# EAGLE design 副机 插座 v0.4 (EAGLE 6.3)
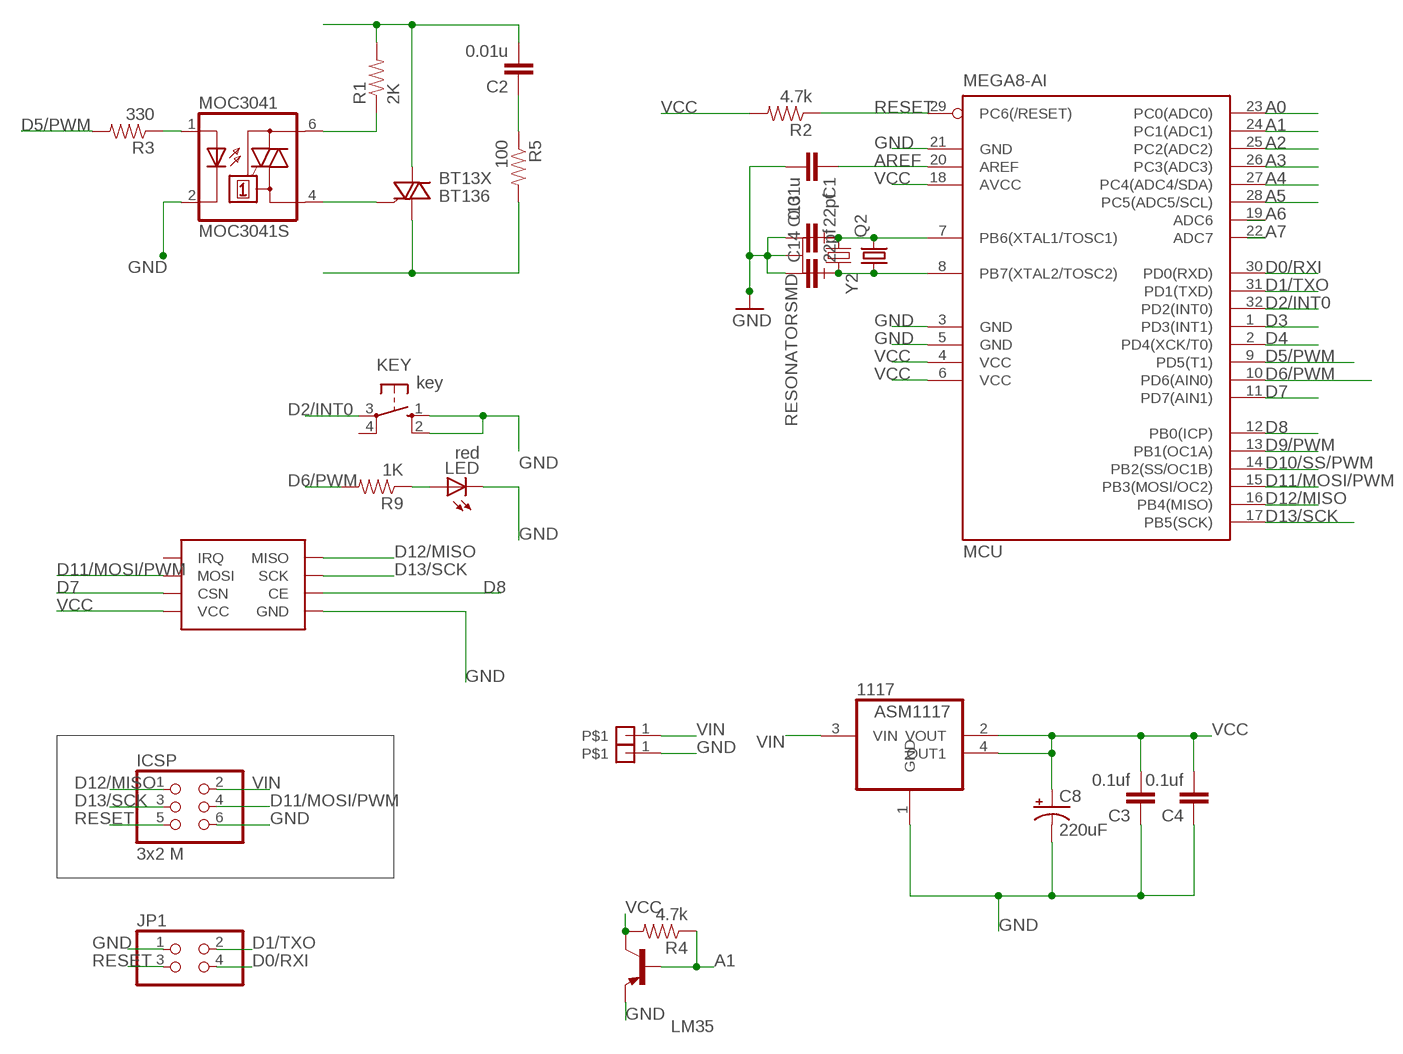
[diagram p0: schematic, sheet 1]

## Parts
1117  ASM1117  [SOT223]
BT13X  BT136  [TO252]
C1  0.01u  CAP0603-CAP  [0603-CAP]
C2  0.01u  C-EU050-024X044  [C050-024X044]
C3  0.1uf  CAP0603-CAP  [0603-CAP]
C4  0.1uf  CAP0603-CAP  [0603-CAP]
C8  220uF  CAP_POL3528  [EIA3528]
C13  22pf  CAP0603-CAP  [0603-CAP]
C14  22pf  CAP0603-CAP  [0603-CAP]
ICSP  3x2 M  PINHD-2X3  [2X03]
JP1  PINHD-2X2  [2X02]
KEY  key  10-XX  [B3F-10XX]
LED  red  LED3MM  [LED3MM]
LM35  -PNP-TO92-E1  [TO92-E1]
MCU  MEGA8-AI  [TQFP32-08]
MOC3041  MOC3041S  [DIL6-SMD]
Q2  CRYSTALHC49S  [HC49/S]
R1  2K  RESISTORPTH1  [AXIAL-0.3]
R2  4.7k  RESISTOR0603-RES  [0603-RES]
R3  330  RESISTOR0603-RES  [0603-RES]
R4  4.7k  RESISTOR0603-RES  [0603-RES]
R5  100  RESISTORPTH1  [AXIAL-0.3]
R9  1K  RESISTOR0603-RES  [0603-RES]
U$3  PIN1  [PIN1]
U$4  PIN1  [PIN1]
U$6  NRF  [NRF]
Y2  RESONATORSMD  [RESONATOR-SMD]

## Nets
A0: MCU.23(PC0(ADC0))
A1: LM35.2(B) MCU.24(PC1(ADC1)) R4.1
A2: MCU.25(PC2(ADC2))
A3: MCU.26(PC3(ADC3))
A4: MCU.27(PC4(ADC4/SDA))
A5: MCU.28(PC5(ADC5/SCL))
A6: MCU.19(ADC6)
A7: MCU.22(ADC7)
AREF: C1.1 MCU.20(AREF)
D0/RXI: JP1.4 MCU.30(PD0(RXD))
D1/TXO: JP1.2 MCU.31(PD1(TXD))
D2/INT0: KEY.3(P) MCU.32(PD2(INT0))
D3: MCU.1(PD3(INT1))
D4: MCU.2(PD4(XCK/T0))
D5/PWM: MCU.9(PD5(T1)) R3.2
D6/PWM: MCU.10(PD6(AIN0)) R9.2
D7: MCU.11(PD7(AIN1)) U$6.P$4(CSN)
D8: MCU.12(PB0(ICP)) U$6.P$3(CE)
D9/PWM: MCU.13(PB1(OC1A))
D10/SS/PWM: MCU.14(PB2(SS/OC1B))
D11/MOSI/PWM: ICSP.4 MCU.15(PB3(MOSI/OC2)) U$6.P$6(MOSI)
D12/MISO: ICSP.1 MCU.16(PB4(MISO)) U$6.P$7(MISO)
D13/SCK: ICSP.3 MCU.17(PB5(SCK)) U$6.P$5(SCK)
GND: 1117.1(GND) C1.2 C3.1 C4.1 C8.C(-) C13.1 C14.1 ICSP.6 JP1.1 KEY.1(S) KEY.2(S1) LED.K(C) LM35.3(E) MCU.3(GND) MCU.5(GND) MCU.21(GND) MOC3041.2(C) U$4.1 U$6.P$1(GND) Y2.2
IN: BT13X.3(A2) C2.2 R1.P$2
N$1: MOC3041.6(A2) R1.P$1
N$2: BT13X.2(G) MOC3041.4(A1)
N$3: C2.1 R5.P$1
N$15: LED.A R9.1
N$34: C13.2 MCU.7(PB6(XTAL1/TOSC1)) Q2.2 Y2.1
N$35: C14.2 MCU.8(PB7(XTAL2/TOSC2)) Q2.1 Y2.3
OUT: BT13X.1(A1) R5.P$2
P1: MOC3041.1(A) R3.1
RESET: ICSP.5 JP1.3 MCU.29(PC6(/RESET)) R2.1
VCC: 1117.2(VOUT) 1117.4(OUT1) C3.2 C4.2 C8.A(+) LM35.1(C) MCU.4(VCC) MCU.6(VCC) MCU.18(AVCC) R2.2 R4.2 U$6.P$2(VCC)
VIN: 1117.3(VIN) ICSP.2 U$3.1
Unconnected: KEY.4(P1) U$6.P$8(IRQ)

## Library data of the parts
1117 = MY3:ASM1117: 800mA and 1A Low Dropout (LDO) Positive Regulator 1.8V, 2.5V, 2.85V, 3.3V, 5V, and Adj; MPN: REG1117; OC_FARNELL: 1097566; OC_NEWARK: 14P6981
BT13X = PKJ:BT136: Triac BT136 series E sensitive gate Source: http://www.nxp.com/acrobat_download/datasheets/BT136_SERIES_E_2.pdf
C1 = MY2:CAP: Capacitor Standard 0603 ceramic capacitor, and 0.1" leaded capacitor.
C2 = resistor:C-EU: CAPACITOR, European symbol
C3 C4 = MY:CAP: Capacitor Standard 0603 ceramic capacitor, and 0.1" leaded capacitor.
C8 = MY:CAP_POL: Capacitor Polarized These are standard SMD and PTH capacitors. Normally 10uF, 47uF, and 100uF in electrolytic and tantalum varieties. Always verify the external diameter of the through hole cap, it varies with capacity, voltage, and manufacturer. The EIA devices should be standard.
C13 C14 = 00my:CAP: Capacitor Standard 0603 ceramic capacitor, and 0.1" leaded capacitor.
ICSP = SmartPrj:PINHD-2X3: PIN HEADER
JP1 = pinhead:PINHD-2X2: PIN HEADER
KEY = switch-omron:10-XX: OMRON SWITCH; MPN: B3F-1000; OC_FARNELL: 176432; OC_NEWARK: 36M3542
LED = led:LED: LED OSRAM: - CHIPLED LG R971, LG N971, LY N971, LG Q971, LY Q971, LO R971, LY R971 LH N974, LH R974 LS Q976, LO Q976, LY Q976 LO Q996 - Hyper CHIPLED LW Q18S LB Q993, LB Q99A, LB R99A - SideLED LS A670, LO A670, LY A670, LG A670, LP A670 LB A673, LV A673, LT A673, LW A673 LH A674 LY A675 LS A676, LA A676, LO A676, LY A676, LW A676 LS A679, LY A679, LG A679 - Hyper Micro SIDELED® LS Y876, LA Y876, LO Y876, LY Y876 LT Y87S - SmartLED LW L88C, LW L88S LB L89C, LB L89S, LG L890 LS L89K, LO L89K, LY L89K LS L896, LA L896, LO L896, LY L896 - TOPLED LS T670, LO T670, LY T670, LG T670, LP T670 LSG T670, LSP T670, LSY T670, LOP T670, LYG T670 LG T671, LOG T671, LSG T671 LB T673, LV T673, LT T673, LW T673 LH T674 LS T676, LA T676, LO T676, LY T676, LB T676, LH T676, LSB T676, LW T676 LB T67C, LV T67C, LT T67C, LS T67K, LO T67K, LY T67K, LW E67C LS E67B, LA E67B, LO E67B, LY E67B, LB E67C, LV E67C, LT E67C LW T67C LS T679, LY T679, LG T679 LS T770, LO T770, LY T770, LG T770, LP T770 LB T773, LV T773, LT T773, LW T773 LH T774 LS E675, LA E675, LY E675, LS T675 LS T776, LA T776, LO T776, LY T776, LB T776 LHGB T686 LT T68C, LB T68C - Hyper Mini TOPLED® LB M676 - Mini TOPLED Santana® LG M470 LS M47K, LO M47K, LY M47K Source: http://www.osram.convergy.de LUXEON: - LUMILED® LXK2-PW12-R00, LXK2-PW12-S00, LXK2-PW14-U00, LXK2-PW14-V00 LXK2-PM12-R00, LXK2-PM12-S00, LXK2-PM14-U00 LXK2-PE12-Q00, LXK2-PE12-R00, LXK2-PE12-S00, LXK2-PE14-T00, LXK2-PE14-U00 LXK2-PB12-K00, LXK2-PB12-L00, LXK2-PB12-M00, LXK2-PB14-N00, LXK2-PB14-P00, LXK2-PB14-Q00 LXK2-PR12-L00, LXK2-PR12-M00, LXK2-PR14-Q00, LXK2-PR14-R00 LXK2-PD12-Q00, LXK2-PD12-R00, LXK2-PD12-S00 LXK2-PH12-R00, LXK2-PH12-S00 LXK2-PL12-P00, LXK2-PL12-Q00, LXK2-PL12-R00 Source: www.luxeon.com KINGBRIGHT: KA-3528ASYC Source: www.kingbright.com
LM35 = transistor-neu-to92:*-PNP-: PNP Transistror
MCU = atmel:MEGA8: MICROCONTROLLER 8 Kbytes FLASH, 1 kbytes SRAM, 512 bytes EEPROM, USART, 6-channel 10 bit ADC, 2-channel 8 bit ADC Pin compatible with Atmega48, ATMega88, ATMega168 Source: avr.lbr; MPN: ATMEGA8-16AU; OC_FARNELL: 9171371; OC_NEWARK: 73M8863
MOC3041 = optocoupler:MOC30*: 6-Pin DIP Zero-Cross Optoisolators Triac Driver Output (250/400 Volt Peak) Source: http://www.fairchildsemi.com/ds/MO/MOC3043-M.pdf; MF: FAIRCHILD SEMICONDUCTOR; MPN: MOC3041S-M; OC_FARNELL: unknown; OC_NEWARK: 05C2885
Q2 = crystal:CRYSTAL: CRYSTAL; OC_FARNELL: 1667008; OC_NEWARK: unknown
R1 R5 = MY3:RESISTOR: Resistor Basic schematic elements and footprints for 0603, 1206, and PTH 1/10th watt (small) resistors.
R2-R4 R9 = MY:RESISTOR: Resistor Basic schematic elements and footprints for 0603, 1206, and PTH 1/10th watt (small) resistors.
U$3 U$4 = PKJ:PIN1
U$6 = PKJ:NRF
Y2 = MY:RESONATOR: Resonator Small SMD resonator. This is the itty bitty 10/20MHz resonators with built in caps. CSTCE10M0G55 and CSTCE20M0V53. Footprint has been reviewed closely but hasn't been tested yet.

## Net classes
1 power: width 0.381 mm
2 gnd: width 0.305 mm, drill 0.559 mm, clearance 0.254 mm
3 usbvcc: width 0.508 mm, drill 0.61 mm, clearance 0.254 mm

## Board
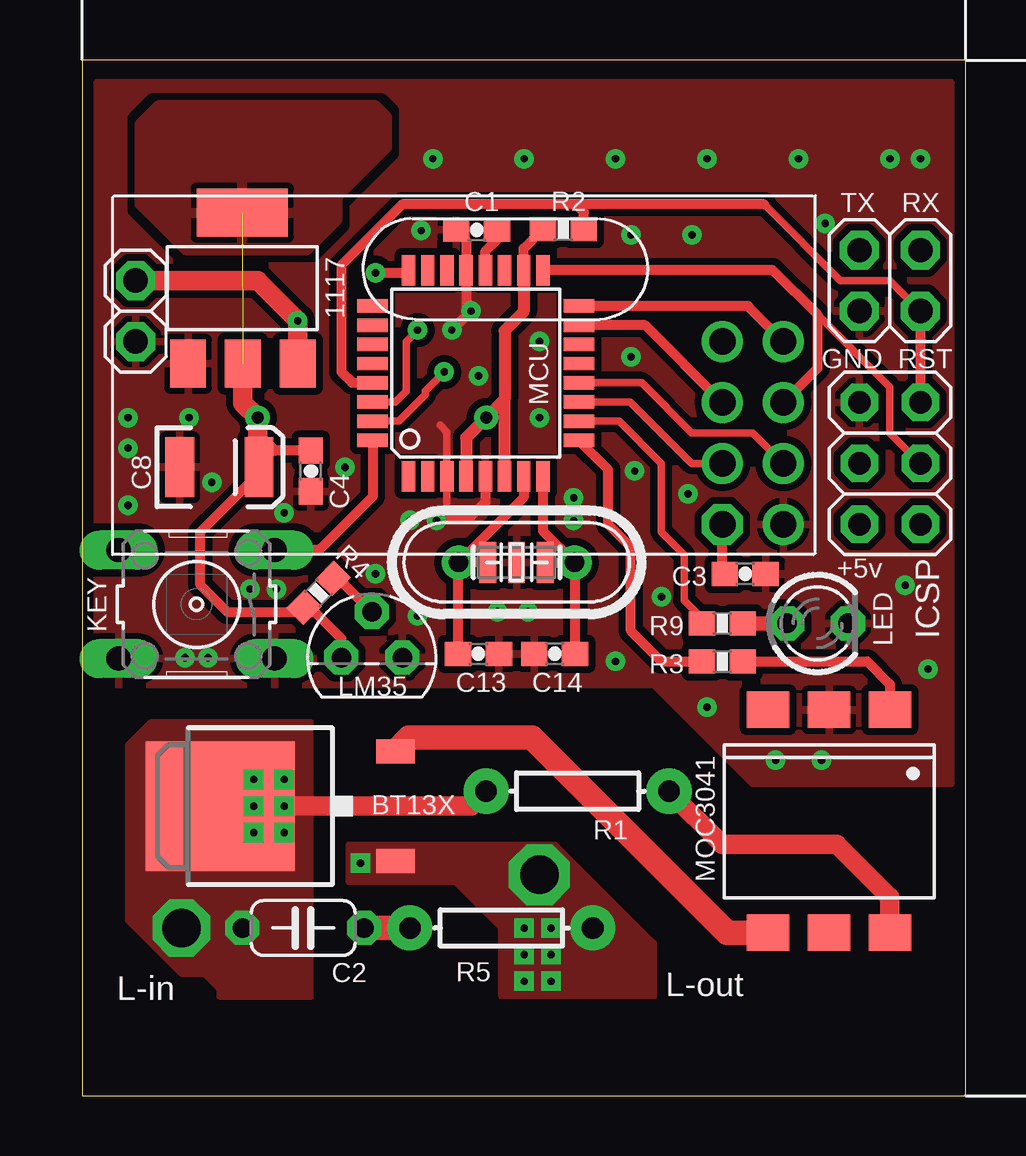
[diagram p1: board, top side]
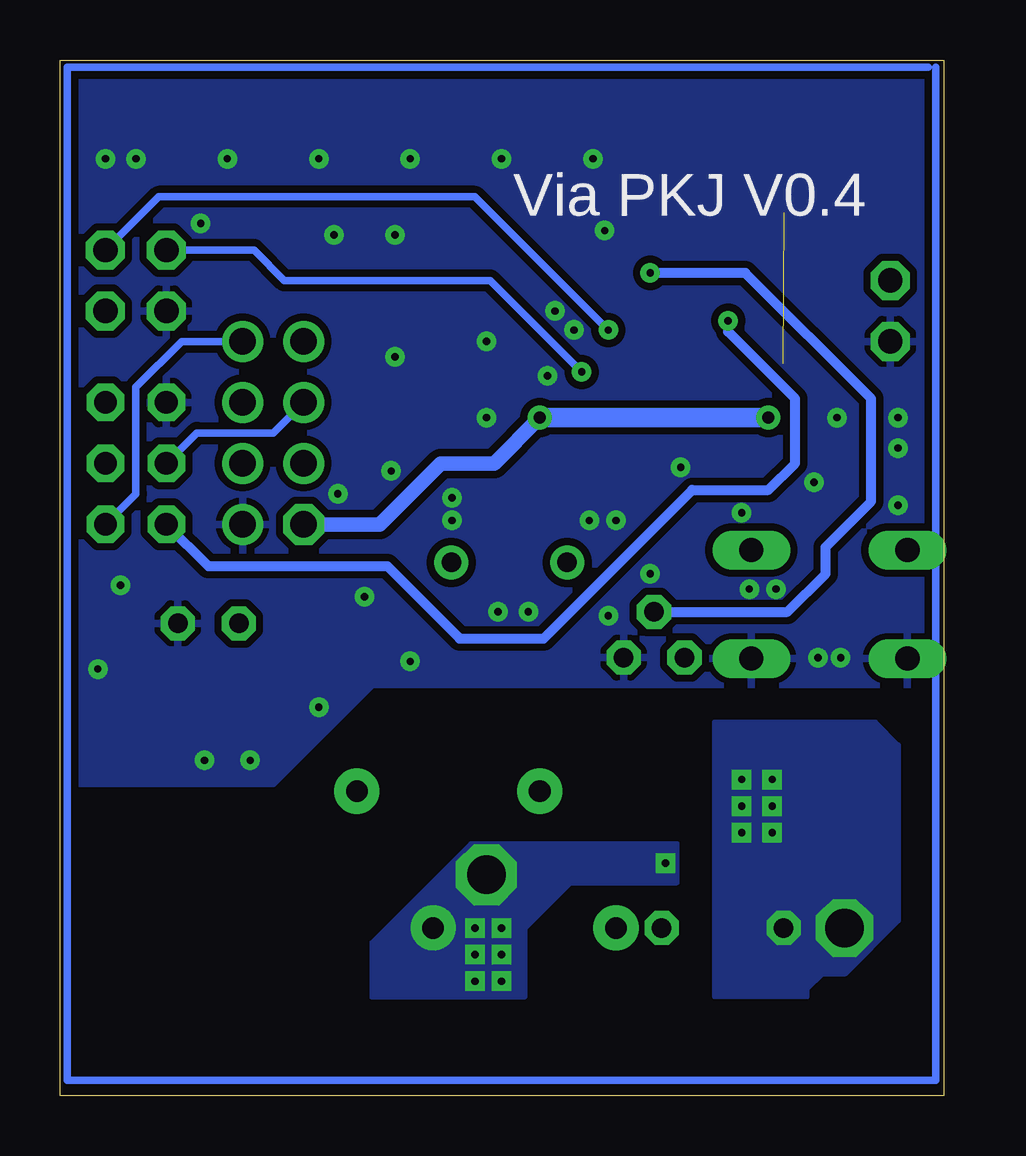
[diagram p2: board, bottom side, seen from below]

Size 36.81 x 43.17 mm. Coordinates in mm from the lower left corner, seen from the top.
Outline: 0,0 36.81,0 36.81,43.17 0,43.17 0,0
Copper layers (1*16): Top 0.035mm / dielectric 1.5mm / Bottom 0.035mm
Design rules "pkjok *": minimum track width 8mil, minimum drill 8mil, track to track 8mil, track to pad 8mil, pad to pad 8mil, via to via 8mil, smd to smd 8mil, copper to edge 10mil, drill to drill 8mil, minimum pad ring 12mil, minimum via ring 10mil, stop-mask expansion 4mil, vias tented up to drill 8mil, thermal gap 10mil

### Footprints (pad centres in the part's own frame; a part is rotated, then mirrored left to right if it is on the bottom)
SOT223 = smd 1.499 x 2.007: 1 -2.261,-3.15; 2 0.025,-3.15; 3 2.311,-3.15 | smd 3.81 x 2.007: 4 0,3.15
TO252 = smd 1 x 1.6: 1 -2.28,-4.8; 2 2.28,-4.8 | smd 5.4 x 6.2: 3 0,2.5
0603-CAP = smd 1.1 x 1: 1 -0.85,0; 2 0.85,0
C050-024X044 = drill 0.813 octagon: 1 -2.54,0; 2 2.54,0
EIA3528 = smd 1.2 x 2.5: A 1.65,0; C -1.65,0
2X03 = drill 0.95 pad 1.55 octagon: 1 -2.54,-1.27; 2 -2.54,1.27; 3 0,-1.27; 4 0,1.27; 5 2.54,-1.27; 6 2.54,1.27
2X02 = drill 1.016 octagon: 1 -1.27,-1.27; 2 -1.27,1.27; 3 1.27,-1.27; 4 1.27,1.27
B3F-10XX = drill 1.016 long: 1 -3.251,2.261; 2 3.251,2.261; 3 -3.251,-2.261; 4 3.251,-2.261
LED3MM = drill 0.813 octagon: A -1.27,0; K 1.27,0
TO92-E1 = drill 0.813 octagon: 1 -1.27,0; 2 0,1.905; 3 1.27,0
TQFP32-08 = smd 1.27 x 0.559: 1 -4.293,2.8; 2 -4.293,2; 3 -4.293,1.2; 4 -4.293,0.4; 5 -4.293,-0.4; 6 -4.293,-1.2; 7 -4.293,-2; 8 -4.293,-2.8; 17 4.293,-2.8; 18 4.293,-2; 19 4.293,-1.2; 20 4.293,-0.4; 21 4.293,0.4; 22 4.293,1.2; 23 4.293,2; 24 4.293,2.8 | smd 0.559 x 1.27: 9 -2.8,-4.293; 10 -2,-4.293; 11 -1.2,-4.293; 12 -0.4,-4.293; 13 0.4,-4.293; 14 1.2,-4.293; 15 2,-4.293; 16 2.8,-4.293; 25 2.8,4.293; 26 2,4.293; 27 1.2,4.293; 28 0.4,4.293; 29 -0.4,4.293; 30 -1.2,4.293; 31 -2,4.293; 32 -2.8,4.293
DIL6-SMD = smd 1.78 x 1.52: 1 -2.54,-4.645; 2 0,-4.645; 3 2.54,-4.645; 4 2.54,4.645; 5 0,4.645; 6 -2.54,4.645
HC49/S = drill 0.813: 1 -2.413,0; 2 2.413,0
AXIAL-0.3 = drill 0.9 pad 1.88: P$1 -3.81,0; P$2 3.81,0
0603-RES = smd 1.1 x 1: 1 -0.85,0; 2 0.85,0
PIN1 = drill 1.016 octagon: 1 0,0
NRF = drill 1.1: P$1 2.54,-2.54; P$3 2.54,0; P$4 0,0; P$5 2.54,2.54; P$6 0,2.54; P$7 2.54,5.08; P$8 0,5.08 | drill 1.1 octagon: P$2 0,-2.54
RESONATOR-SMD = smd 0.7 x 1.7: 1 -1.2,0; 2 0,0; 3 1.2,0

### Placement (x,y rotation side)
1117  6.67,33.66 0 top
BT13X  8.26,12.06 90 top
C1  16.43,36.09 180 top
C2  9.21,6.98 180 top
C3  27.62,21.75 180 top
C4  9.53,26.03 90 top
C8  5.71,26.19 0 top
C13  16.51,18.41 180 top
C14  19.68,18.41 0 top
ICSP  33.66,26.35 90 top
JP1  33.66,33.97 0 top
KEY  4.76,20.48 180 top
LED  30.64,19.69 0 top
LM35  12.06,18.26 0 top
MCU  16.4,30.11 90 top
MOC3041  31.11,11.43 180 top
Q2  18.1,22.23 180 top
R1  20.64,12.69 180 top
R2  20.05,36.11 180 top
R3  26.67,18.1 180 top
R4  9.84,20.95 225 top
R5  17.46,6.98 0 top
R9  26.67,19.69 180 top
U$3  2.22,33.97 0 top
U$4  2.22,31.43 0 top
U$6  26.67,26.35 0 top
Y2  18.1,22.23 0 top

### Tracks (layer width: path | path; a pad name or v marks a point on that pad's centre or on a via)
A1  (via drill 0.3)
  Top 0.406: MCU.24 13.48,34.29 v12.22,34.29 | R4.1 10.92,21.31 LM35.2
  Bottom 0.406: v12.22,34.29 8.26,34.29 3.02,29.05 3.02,24.76 4.92,22.86 4.92,21.75 6.51,20.16 LM35.2
AREF
  Top 0.406: MCU.20 16.8,35.2 17.28,35.69 C1.1
D0/RXI  (via drill 0.3)
  Top 0.305: MCU.30 13.04,28.91 13.49,29.37 13.49,31.43 v13.97,31.91
  Bottom 0.305: v13.97,31.91 19.53,37.46 32.7,37.46 JP1.4
D1/TXO  (via drill 0.3)
  Top 0.305: MCU.31 13.19,28.11 14.29,29.21 14.29,29.37 v15.08,30.16
  Bottom 0.305: v15.08,30.16 18.89,33.97 27.46,33.97 28.73,35.24 JP1.2
D2/INT0
  Top 0.406: MCU.32 12.1,24.96 9.88,22.74 KEY.3
D5/PWM
  Top 0.406: MCU.9 21.91,26.09 21.91,23.81 22.86,22.86 22.86,19.37 24.13,18.1 R3.2
D6/PWM
  Top 0.305: MCU.10 22.37,28.11 24.13,26.35 24.13,23.49 25.08,22.54 25.08,20.64 25.82,19.9 R9.2
D7
  Top 0.305: U$6.P$4 25.4,26.35 22.84,28.91 MCU.11
D8
  Top 0.305: U$6.P$3 27.94,27.62 25.4,27.62 23.31,29.71 MCU.12
D11/MOSI/PWM
  Top 0.406: U$6.P$6 23.45,32.11 MCU.15
  Bottom 0.305: ICSP.4 31.11,27.62 27.94,27.62 U$6.P$6
D12/MISO
  Top 0.406: U$6.P$7 27.73,32.91 MCU.16
  Bottom 0.305: ICSP.1 33.66,25.08 33.66,29.53 31.75,31.43 U$6.P$7
D13/SCK
  Top 0.305: ICSP.3 33.66,27.62 33.66,29.53 30.64,32.54
  Top 0.406: U$6.P$5 30.64,30.32 30.64,32.54 28.78,34.4 MCU.17
GND  (via drill 0.3)
  Top 0.305: MCU.3 15.2,27.67 14.92,27.94 | 15.2,24.72 15.2,25.67 15.24,25.72
  Top 0.406: MCU.5 16.8,24.73 16.19,24.13 14.61,24.13 | v15.4,31.91 16,32.51 MCU.21 16,35.63 15.54,36.08 15.57,36.08 C1.2
  other vias: 24.13,20.8 16.19,32.7 34.93,39.05 30.96,36.35 25.4,35.88 22.86,35.88 19.05,28.26 26.04,16.19 34.29,21.27 35.24,17.78 20.48,24.92 17.3,20.16 14.12,36.06 16.51,30 33.66,39.05 29.84,39.05 26.04,39.05 22.22,39.05 18.41,39.05 14.61,39.05 22.86,30.8 1.91,26.99 1.91,24.61 1.91,28.26 19.05,31.43 5.4,25.56 4.45,28.26 18.57,20.16 28.89,13.97 30.8,13.97 8.41,24.29 10.95,26.19 13.65,23.97 14.76,23.97 20.48,23.97 22.22,18.1 4.29,18.26 5.24,18.26 8.1,21.11 6.99,21.11 13.97,20 12.22,21.75 23.02,26.03 25.24,25.08
  pour Bottom (isolate 0.305, rank 6): 0.64,42.23 36.2,42.23 36.2,13.02 27.94,13.02 23.81,17.15 0.64,17.15
  pour Top (isolate 0.305, rank 6): 0.64,42.23 36.2,42.23 36.2,13.02 27.94,13.02 23.81,17.15 0.64,17.15
IN  (via drill 0.3, 1.6)
  Top 0.813: R1.P$2 16.2,12.06 BT13X.3
  other vias: 4.13,6.98 7.14,13.18 7.14,12.06 7.14,10.95 8.41,13.18 8.41,12.06 8.41,10.95
  pour Top (rank 5, no thermals): 9.53,4.13 9.53,15.56 2.86,15.56 1.91,14.6 1.91,7.3 4.13,5.08 5.08,5.08 5.71,4.45 5.71,4.13
  pour Bottom (rank 5, no thermals): 9.53,4.13 9.53,15.56 2.86,15.56 1.91,14.6 1.91,7.3 4.13,5.08 5.08,5.08 5.71,4.45 5.71,4.13
N$1
  Top 0.813: MOC3041.6 33.66,8.26 31.43,10.48 26.66,10.48 R1.P$1
N$2
  Top 1.016: BT13X.2 13.63,14.92 18.73,14.92 26.87,6.79 MOC3041.4
N$3
  Top 1.016: R5.P$1 C2.1
N$14
  Bottom 0.305: 0.64,42.86 36.51,42.86 36.51,0.64 0.32,0.64 0.32,42.86
N$15
  Top 0.61: R9.1 LED.A
N$34
  Top 0.406: MCU.7 18.4,24.94 Q2.2 | C13.2 15.66,22.2 Q2.2 | Y2.1 Q2.2
N$35
  Top 0.406: MCU.8 19.2,23.54 Q2.1 | C14.2 20.54,22.2 Q2.1 | Y2.3 Q2.1
OUT  (via drill 0.3, 1.6 pad 2.54)
  other vias: 19.05,9.21 18.41,6.98 18.41,5.87 18.41,4.76 19.53,6.98 19.53,5.87 19.53,4.76 11.59,9.68
  pour Bottom (isolate 0.61, rank 5, no thermals): 11.11,8.89 11.11,10.48 19.68,10.48 23.81,6.35 23.81,4.13 17.46,4.13 17.46,6.98 15.56,8.89
  pour Top (isolate 0.61, rank 5, no thermals): 11.11,8.89 11.11,10.48 19.68,10.48 23.81,6.35 23.81,4.13 17.46,4.13 17.46,6.98 15.56,8.89
P1
  Top 0.406: R3.1 32.7,18.1 33.66,17.15 MOC3041.1
RESET
  Top 0.305: 28.42,37.15 31.59,33.97 33.66,33.97 JP1.3
  Top 0.406: 28.42,37.15 20.57,37.15 | 20.57,37.15 13.34,37.15 10.79,34.61 10.79,30.16 11.25,29.71 MCU.29 | R2.1 20.9,36.82 20.57,37.15 | JP1.3 ICSP.5
VCC  (via drill 0.5)  (1 unrouted)
  Top 0.406: C3.2 26.67,22.17 U$6.P$2 | C8.A 7.3,25.78 | MCU.18 18.4,35.3 R2.2 | C4.2 8.04,26.88 7.3,27.62 | 7.3,25.88 4.92,23.49 4.92,21.27 6.03,20.16 9.68,20.16 | 9.68,20.16 10.79,19.05 LM35.1 | R4.2 9.68,20.16
  Top 0.508: 17.6,29.03 v16.83,28.26 16,27.43 MCU.4 | MCU.6 17.6,29.03 | MCU.18 18.4,32.68 17.6,31.88 17.6,29.03
  Top 0.813: 1117.2 6.69,28.87 v7.3,28.26 7.3,27.62 7.3,25.88 7.3,25.78
  Bottom 0.61: U$6.P$2 23.49,23.81 20.95,26.35 18.73,26.35 v16.83,28.26
  Bottom 0.813: v7.3,28.26 v16.83,28.26
  pour Top (isolate 0.406): 4.29,35.24 9.37,35.24 10.64,36.51 10.64,37.46 12.7,39.53 12.7,40.8 12.22,41.27 3.17,41.27 2.38,40.48 2.38,37.15
VIN  (via drill 0.3)
  Top 0.406: 5.08,33.97 4.45,33.97
  Top 0.813: U$3.1 4.45,33.97 7.3,33.97 v8.98,32.3 1117.3
  Bottom 0.406: ICSP.2 30.64,22.07 23.18,22.07 20.16,19.05 16.67,19.05 10.48,25.24 7.3,25.24 6.19,26.35 6.19,29.05 8.98,31.84 v8.98,32.3

### Text on the board
tPlace: TX | RX | GND | RST | +5v | L-in | L-out
bPlace: Via PKJ V0.4
tStop: G